# EAGLE design ton-fit_v2 (EAGLE 8.7.0)
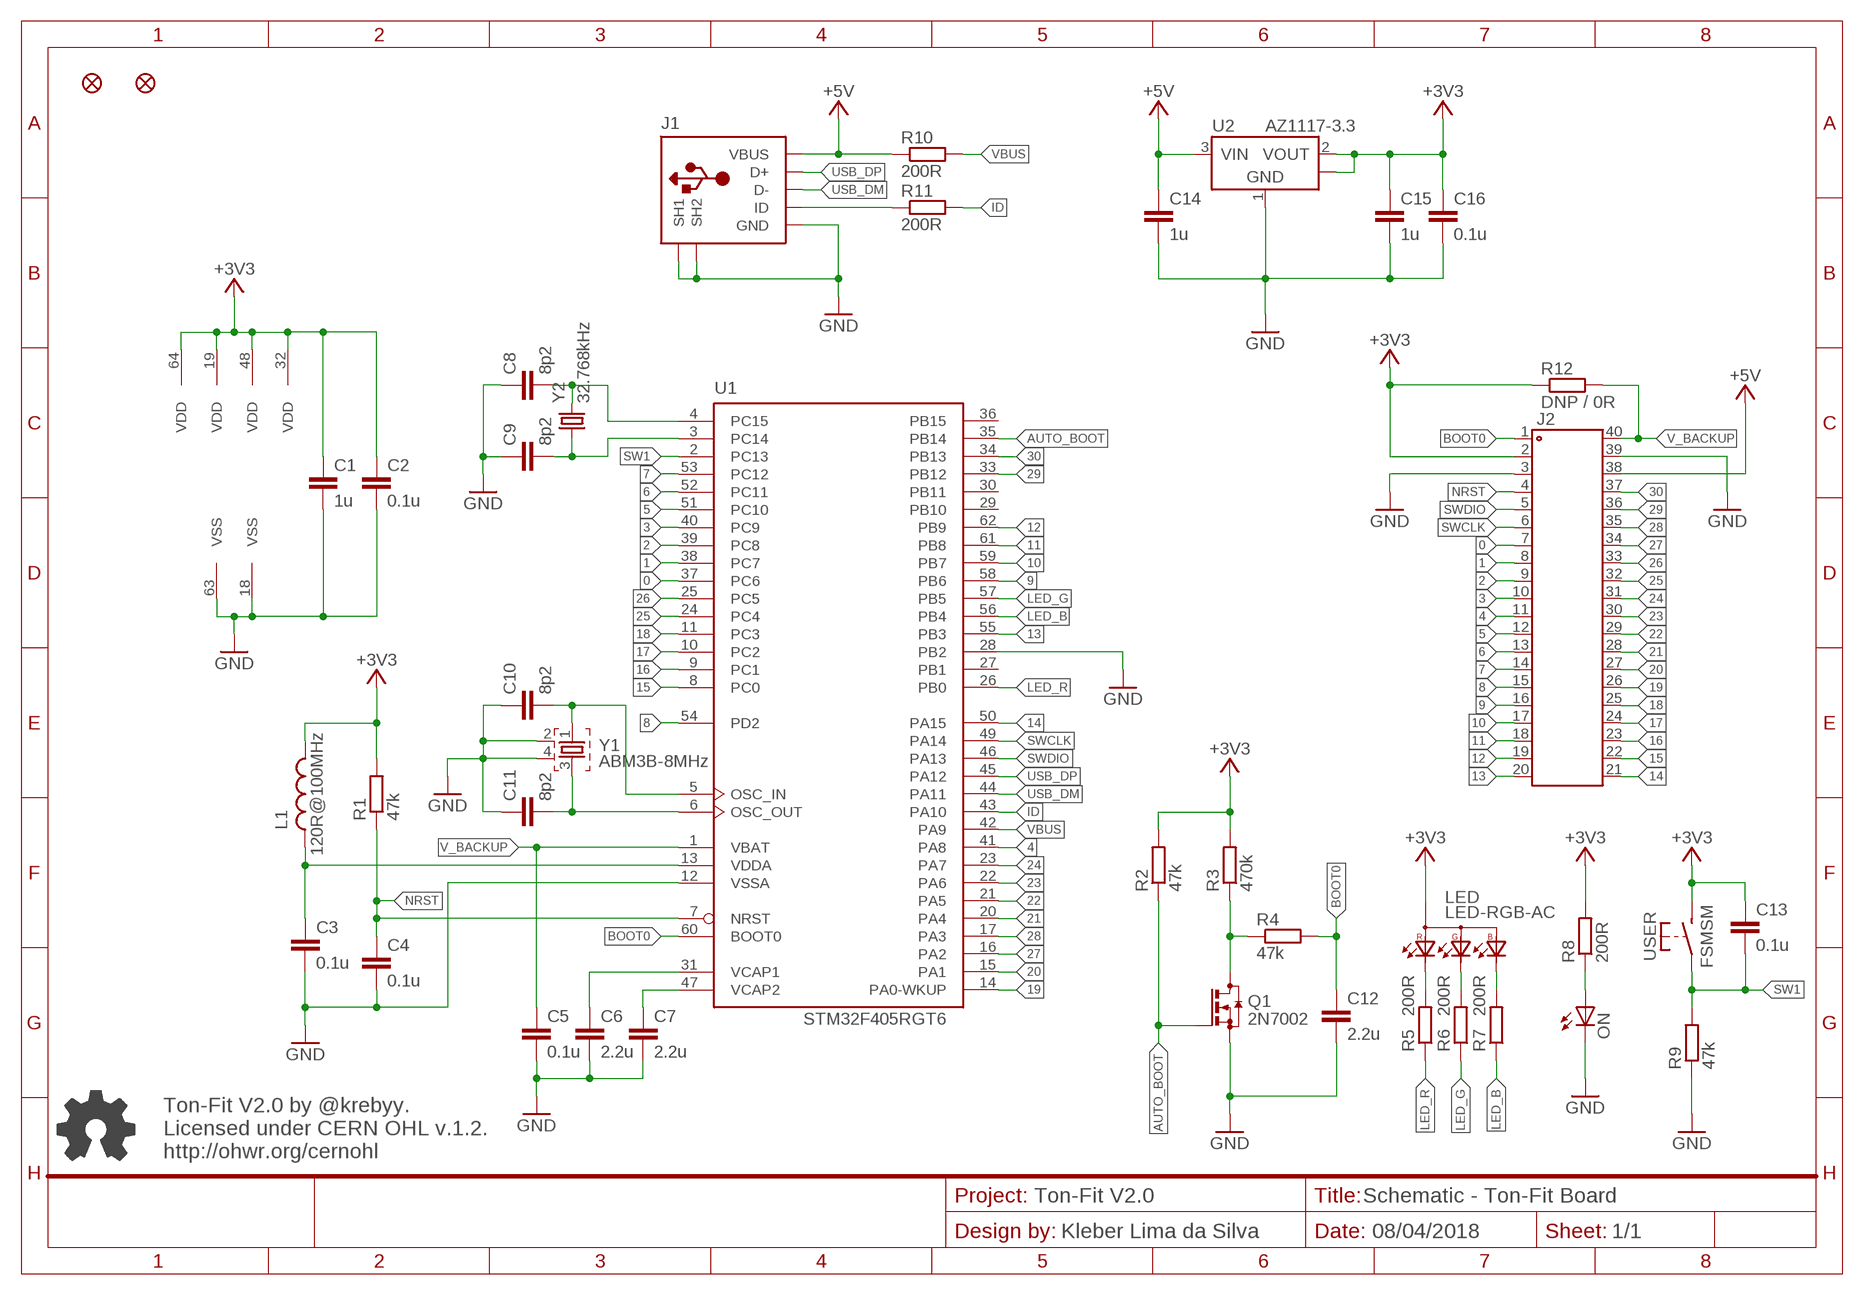
[diagram p0: schematic, sheet 1]

## Parts
C1  1u  C-0603  [C0603]
C2  0.1u  C-0603  [C0603]
C3  0.1u  C-0603  [C0603]
C4  0.1u  C-0603  [C0603]
C5  0.1u  C-0603  [C0603]
C6  2.2u  C-0603  [C0603]
C7  2.2u  C-0603  [C0603]
C8  8p2  C-0603  [C0603]
C9  8p2  C-0603  [C0603]
C10  8p2  C-0603  [C0603]
C11  8p2  C-0603  [C0603]
C12  2.2u  C-0603  [C0603]
C13  0.1u  C-0603  [C0603]
C14  1u  C-0603  [C0603]
C15  1u  C-0603  [C0603]
C16  0.1u  C-0603  [C0603]
FIDUCIAL1  FIDUCIAL  [FIDUCIAL-1X2]
FIDUCIAL2  FIDUCIAL  [FIDUCIAL-1X2]
J1  USBR  [0475890001]
J2  DIL40  [DIL40]
L1  120R@100MHz  L-0603  [L0603]
LED  LED-RGB-AC  [0606]
ON  LEDCHIPLED_0603  [CHIPLED_0603]
Q1  2N7002  N-MOS-SOT23  [SOT23]
R1  47k  R-0603  [R0603]
R2  47k  R-0603  [R0603]
R3  470k  R-0603  [R0603]
R4  47k  R-0603  [R0603]
R5  200R  R-0603  [R0603]
R6  200R  R-0603  [R0603]
R7  200R  R-0603  [R0603]
R8  200R  R-0603  [R0603]
R9  47k  R-0603  [R0603]
R10  200R  R-0603  [R0603]
R11  200R  R-0603  [R0603]
R12  DNP / 0R  R-0603  [R0603]
U1  STM32F405RGT6  STM32F405RGT  [LQFP64]
U2  AZ1117-3.3  V-REG  [SOT223]
USER  FSMSM  SW-MON  [FSMSM]
Y1  ABM3B-8MHz  FA-ABM3B  [ABM3B]
Y2  32.768kHz  CRYSTAL_32.768K  [3.2X1.5]

## Nets
0: J2.7 U1.37(PC6)
1: J2.8 U1.38(PC7)
2: J2.9 U1.39(PC8)
3: J2.10 U1.40(PC9)
4: J2.11 U1.41(PA8)
5: J2.12 U1.51(PC10)
6: J2.13 U1.52(PC11)
7: J2.14 U1.53(PC12)
8: J2.15 U1.54(PD2)
9: J2.16 U1.58(PB6)
10: J2.17 U1.59(PB7)
11: J2.18 U1.61(PB8)
12: J2.19 U1.62(PB9)
13: J2.20 U1.55(PB3)
14: J2.21 U1.50(PA15)
15: J2.22 U1.8(PC0)
16: J2.23 U1.9(PC1)
17: J2.24 U1.10(PC2)
18: J2.25 U1.11(PC3)
19: J2.26 U1.14(PA0-WKUP)
20: J2.27 U1.15(PA1)
21: J2.28 U1.20(PA4)
22: J2.29 U1.21(PA5)
23: J2.30 U1.22(PA6)
24: J2.31 U1.23(PA7)
25: J2.32 U1.24(PC4)
26: J2.33 U1.25(PC5)
27: J2.34 U1.16(PA2)
28: J2.35 U1.17(PA3)
29: J2.36 U1.33(PB12)
30: J2.37 U1.34(PB13)
+3V3: C1.1 C2.1 C13.1 C15.1 C16.1 J2.2 L1.1 LED.4(A) R1.2 R2.2 R3.2 R8.2 R12.1 U1.19(VDD) U1.32(VDD) U1.48(VDD) U1.64(VDD) U2.2(VOUT) U2.4(TAB) USER.2
+5V: C14.1 J1.1(VBUS) J2.38 R10.1 U2.3(VIN)
AUTO_BOOT: Q1.1(G) R2.1 U1.35(PB14)
BOOT0: C12.1 J2.1 R4.2 U1.60(BOOT0)
GND: C1.2 C2.2 C3.2 C4.2 C5.2 C6.2 C7.2 C8.1 C9.1 C10.1 C11.1 C12.2 C14.2 C15.2 C16.2 J1.5(GND) J1.SH1 J1.SH2(SH1) J1.SH3(SH2) J1.SH4(SH2) J1.SH5(SH1) J1.SH6(SH2) J2.3 J2.39 ON.C Q1.2(S) R9.1 U1.12(VSSA) U1.18(VSS) U1.28(PB2) U1.63(VSS) U2.1(GND) Y1.2 Y1.4
ID: R11.2 U1.43(PA10)
LED_B: R7.1 U1.56(PB4)
LED_G: R6.1 U1.57(PB5)
LED_R: R5.1 U1.26(PB0)
N$1: C10.2 U1.5(OSC_IN) Y1.1
N$2: C11.2 U1.6(OSC_OUT) Y1.3
N$3: ON.A R8.1
N$4: LED.1(KRED) R5.2
N$5: C6.1 U1.31(VCAP1)
N$6: C7.1 U1.47(VCAP2)
N$7: LED.2(KGREEN) R6.2
N$8: LED.3(KBLUE) R7.2
N$9: C3.1 L1.2 U1.13(VDDA)
N$11: C8.2 U1.4(PC15) Y2.2
N$12: Q1.3(D) R3.1 R4.1
N$15: C9.2 U1.3(PC14) Y2.1
NRST: C4.1 J2.4 R1.1 U1.7(NRST)
SW1: C13.2 R9.2 U1.2(PC13) USER.1
SWCLK: J2.6 U1.49(PA14)
SWDIO: J2.5 U1.46(PA13)
USB_DM: J1.2(D-) U1.44(PA11)
USB_DP: J1.3(D+) U1.45(PA12)
USB_ID: J1.4(ID) R11.1
V_BACKUP: C5.1 J2.40 R12.2 U1.1(VBAT)
VBUS: R10.2 U1.42(PA9)
Unconnected: U1.27(PB1) U1.29(PB10) U1.30(PB11) U1.36(PB15)

## Notes on the sheet
- Ton-Fit V2.0 by @krebyy.
  Licensed under CERN OHL v.1.2.
  http://ohwr.org/cernohl
- Ton-Fit V2.0
- Kleber Lima da Silva

## Library data of the parts
C1-C16 = Exacta-Eagle-Libraries:C-: CAPACITOR
FIDUCIAL1 FIDUCIAL2 = Exacta-Eagle-Libraries:FIDUCIAL: Fiducial PCB mark
J1 = ioton:USB: Hirose MicroUSB A/B Connector
J2 = ioton:DIL40: Dual In Line
L1 = Exacta-Eagle-Libraries:L-: INDUCTOR / FERRITE BEAD
LED = pololu:LED-RGB-AC
ON = led:LED: LED OSRAM: - CHIPLED LG R971, LG N971, LY N971, LG Q971, LY Q971, LO R971, LY R971 LH N974, LH R974 LS Q976, LO Q976, LY Q976 LO Q996 - Hyper CHIPLED LW Q18S LB Q993, LB Q99A, LB R99A - SideLED LS A670, LO A670, LY A670, LG A670, LP A670 LB A673, LV A673, LT A673, LW A673 LH A674 LY A675 LS A676, LA A676, LO A676, LY A676, LW A676 LS A679, LY A679, LG A679 - Hyper Micro SIDELED® LS Y876, LA Y876, LO Y876, LY Y876 LT Y87S - SmartLED LW L88C, LW L88S LB L89C, LB L89S, LG L890 LS L89K, LO L89K, LY L89K LS L896, LA L896, LO L896, LY L896 - TOPLED LS T670, LO T670, LY T670, LG T670, LP T670 LSG T670, LSP T670, LSY T670, LOP T670, LYG T670 LG T671, LOG T671, LSG T671 LB T673, LV T673, LT T673, LW T673 LH T674 LS T676, LA T676, LO T676, LY T676, LB T676, LH T676, LSB T676, LW T676 LB T67C, LV T67C, LT T67C, LS T67K, LO T67K, LY T67K, LW E67C LS E67B, LA E67B, LO E67B, LY E67B, LB E67C, LV E67C, LT E67C LW T67C LS T679, LY T679, LG T679 LS T770, LO T770, LY T770, LG T770, LP T770 LB T773, LV T773, LT T773, LW T773 LH T774 LS E675, LA E675, LY E675, LS T675 LS T776, LA T776, LO T776, LY T776, LB T776 LHGB T686 LT T68C, LB T68C - Hyper Mini TOPLED® LB M676 - Mini TOPLED Santana® LG M470 LS M47K, LO M47K, LY M47K Source: http://www.osram.convergy.de LUXEON: - LUMILED® LXK2-PW12-R00, LXK2-PW12-S00, LXK2-PW14-U00, LXK2-PW14-V00 LXK2-PM12-R00, LXK2-PM12-S00, LXK2-PM14-U00 LXK2-PE12-Q00, LXK2-PE12-R00, LXK2-PE12-S00, LXK2-PE14-T00, LXK2-PE14-U00 LXK2-PB12-K00, LXK2-PB12-L00, LXK2-PB12-M00, LXK2-PB14-N00, LXK2-PB14-P00, LXK2-PB14-Q00 LXK2-PR12-L00, LXK2-PR12-M00, LXK2-PR14-Q00, LXK2-PR14-R00 LXK2-PD12-Q00, LXK2-PD12-R00, LXK2-PD12-S00 LXK2-PH12-R00, LXK2-PH12-S00 LXK2-PL12-P00, LXK2-PL12-Q00, LXK2-PL12-R00 Source: www.luxeon.com KINGBRIGHT: KA-3528ASYC Source: www.kingbright.com
Q1 = Exacta-Eagle-Libraries:N-MOS-: N-channel MOSFET
R1-R12 = Exacta-Eagle-Libraries:R-: RESISTOR
U1 = micro-stm_v2:STM32F405R*T: ARM 32-bit Cortex™-M3 CPU 168 MHz maximum frequency 1024 Kbytes of Flash memory 192 kbytes of SRAM 51 GPIOs 1.8 to 3.6 V application supply
U2 = Exacta-Eagle-Libraries:V-REG: Linear Voltage Regulator
USER = Exacta-Eagle-Libraries:SW-
Y1 = ioton:FA-: MHz RANGE CRYSTAL UNIT Source: Epson Toyocom
Y2 = ioton:CRYSTAL_32.768K

## Board
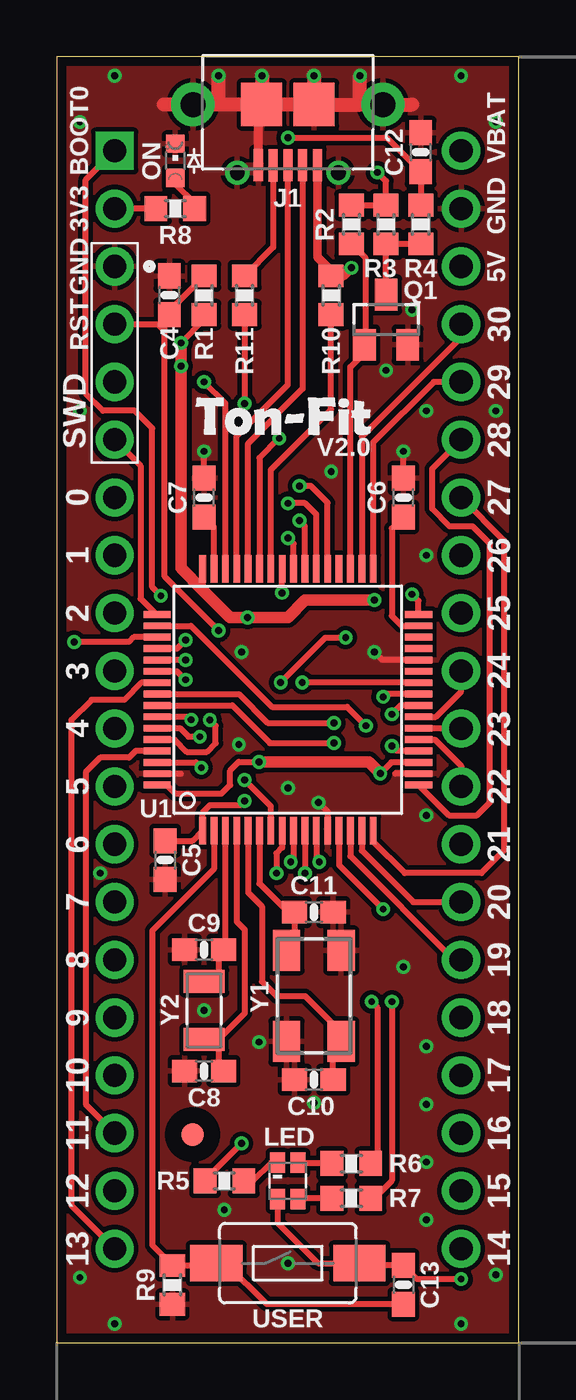
[diagram p1: board, top side]
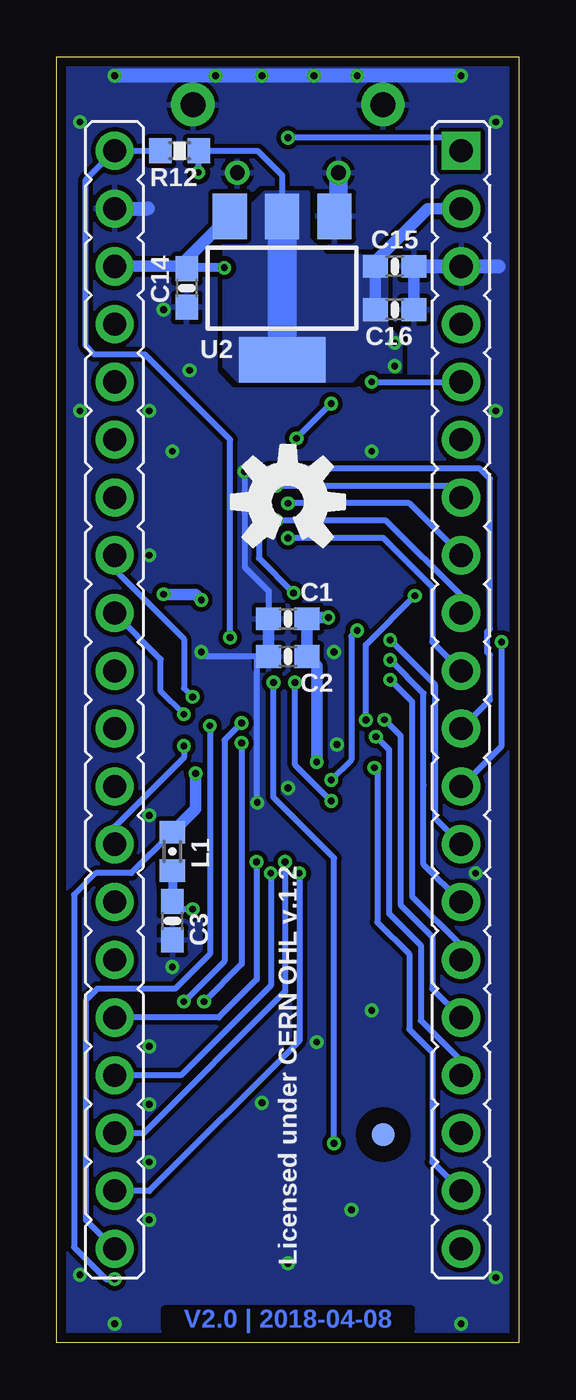
[diagram p2: board, bottom side, seen from below]

Size 20.32 x 56.52 mm. Coordinates in mm from the lower left corner, seen from the top.
Outline: 0,0 20.32,0 20.32,56.52 0,56.52 0,0
Copper layers (1*16): Top 0.035mm / dielectric 1.5mm / Bottom 0.035mm
Design rules "default *": minimum track width 6mil, minimum drill 0.3mm, track to track 8mil, track to pad 7mil, pad to pad 6mil, via to via 7mil, smd to smd 0mil, copper to edge 16mil, drill to drill 8mil, minimum pad ring 8mil, minimum via ring 6mil, stop-mask expansion 4mil, vias tented up to drill 19mil, thermal gap 8mil

### Footprints (pad centres in the part's own frame; a part is rotated, then mirrored left to right if it is on the bottom)
C0603 = smd 1.1 x 1: 1 -0.85,0; 2 0.85,0
FIDUCIAL-1X2 = smd 1 x 1: 1 0,0
0475890001 = smd 0.4 x 1.4: 1 -1.3,2.675; 2 -0.65,2.675; 3 0,2.675; 4 0.65,2.675; 5 1.3,2.675 | drill 1.1 pad 1.9: SH1 -4.175,0; SH4 4.175,0 | smd 1.8 x 1.9: SH2 -1.15,0; SH3 1.15,0 | drill 0.65 pad 1.05: SH5 -2.225,3; SH6 2.225,3
DIL40 = drill 1.016 pad 1.676 square: 1 -24.13,-7.62 | drill 1.016 pad 1.676: 2 -21.59,-7.62; 3 -19.05,-7.62; 4 -16.51,-7.62; 5 -13.97,-7.62; 6 -11.43,-7.62; 7 -8.89,-7.62; 8 -6.35,-7.62; 9 -3.81,-7.62; 10 -1.27,-7.62; 11 1.27,-7.62; 12 3.81,-7.62; 13 6.35,-7.62; 14 8.89,-7.62; 15 11.43,-7.62; 16 13.97,-7.62; 17 16.51,-7.62; 18 19.05,-7.62; 19 21.59,-7.62; 20 24.13,-7.62; 21 24.13,7.62; 22 21.59,7.62; 23 19.05,7.62; 24 16.51,7.62; 25 13.97,7.62; 26 11.43,7.62; 27 8.89,7.62; 28 6.35,7.62; 29 3.81,7.62; 30 1.27,7.62; 31 -1.27,7.62; 32 -3.81,7.62; 33 -6.35,7.62; 34 -8.89,7.62; 35 -11.43,7.62; 36 -13.97,7.62; 37 -16.51,7.62; 38 -19.05,7.62; 39 -21.59,7.62; 40 -24.13,7.62
L0603 = smd 1 x 1.1: 1 -0.85,0; 2 0.85,0
0606 = smd 0.65 x 0.9: 1 -0.45,0.8; 2 0.45,0.8; 3 0.45,-0.8; 4 -0.45,-0.8
CHIPLED_0603 = smd 0.8 x 0.8: A 0,-0.75; C 0,0.75
SOT23 = smd 1 x 1.4: 1 -0.95,-1.1; 2 0.95,-1.1; 3 0,1.1
R0603 = smd 1 x 1.1: 1 -0.85,0; 2 0.85,0
LQFP64 = smd 0.3 x 1.2: 1 -3.75,-5.75; 2 -3.25,-5.75; 3 -2.75,-5.75; 4 -2.25,-5.75; 5 -1.75,-5.75; 6 -1.25,-5.75; 7 -0.75,-5.75; 8 -0.25,-5.75; 9 0.25,-5.75; 10 0.75,-5.75; 11 1.25,-5.75; 12 1.75,-5.75; 13 2.25,-5.75; 14 2.75,-5.75; 15 3.25,-5.75; 16 3.75,-5.75; 33 3.75,5.75; 34 3.25,5.75; 35 2.75,5.75; 36 2.25,5.75; 37 1.75,5.75; 38 1.25,5.75; 39 0.75,5.75; 40 0.25,5.75; 41 -0.25,5.75; 42 -0.75,5.75; 43 -1.25,5.75; 44 -1.75,5.75; 45 -2.25,5.75; 46 -2.75,5.75; 47 -3.25,5.75; 48 -3.75,5.75 | smd 1.2 x 0.3: 17 5.75,-3.75; 18 5.75,-3.25; 19 5.75,-2.75; 20 5.75,-2.25; 21 5.75,-1.75; 22 5.75,-1.25; 23 5.75,-0.75; 24 5.75,-0.25; 25 5.75,0.25; 26 5.75,0.75; 27 5.75,1.25; 28 5.75,1.75; 29 5.75,2.25; 30 5.75,2.75; 31 5.75,3.25; 32 5.75,3.75; 49 -5.75,3.75; 50 -5.75,3.25; 51 -5.75,2.75; 52 -5.75,2.25; 53 -5.75,1.75; 54 -5.75,1.25; 55 -5.75,0.75; 56 -5.75,0.25; 57 -5.75,-0.25; 58 -5.75,-0.75; 59 -5.75,-1.25; 60 -5.75,-1.75; 61 -5.75,-2.25; 62 -5.75,-2.75; 63 -5.75,-3.25; 64 -5.75,-3.75
SOT223 = smd 1.5 x 2: 1 -2.3,-3.15; 2 0,-3.15; 3 2.3,-3.15 | smd 3.8 x 2: 4 0,3.15
FSMSM = smd 2.3 x 1.6: 1 -3.15,0; 2 3.15,0
ABM3B = smd 1.8 x 1.2: 1 -2,-1.2; 2 2,-1.2; 3 2,1.2; 4 -2,1.2
3.2X1.5 = smd 1 x 1.8: 1 -1.275,0; 2 1.275,0

### Placement (x,y rotation side)
C1  10.16,31.81 180 bottom
C2  10.16,30.16 180 bottom
C3  15.24,18.54 270 bottom
C4  4.95,46.04 90 top
C5  4.76,21.21 270 top
C6  15.24,37.15 90 top
C7  6.48,37.15 90 top
C8  6.48,11.94 0 top
C9  6.48,17.27 0 top
C10  11.3,11.56 0 top
C11  11.3,18.92 180 top
C12  16,52.32 90 top
C13  15.24,2.54 270 top
C14  14.61,46.35 270 bottom
C15  5.46,47.31 0 bottom
C16  5.46,45.4 0 bottom
FIDUCIAL1  5.97,9.14 0 top
FIDUCIAL2  5.97,9.14 0 bottom
J1  10.16,54.42 180 top
J2  10.16,28.26 270 top
L1  15.24,21.59 270 bottom
LED  10.16,7.11 0 top
ON  5.21,51.94 0 top
Q1  14.48,44.96 0 top
R1  6.48,46.04 270 top
R2  12.95,49.15 90 top
R3  14.48,49.15 90 top
R4  16,49.15 90 top
R5  7.37,7.11 0 top
R6  12.95,7.87 180 top
R7  12.95,6.35 180 top
R8  5.21,49.85 180 top
R9  5.08,2.54 90 top
R10  12.06,46.04 270 top
R11  8.26,46.04 270 top
R12  14.92,52.39 180 bottom
U1  10.16,28.26 0 top
U2  10.41,46.35 180 bottom
U$1  [OSHW-LOGO-M]  10.16,36.96 0 bottom
USER  10.16,3.49 0 top
Y1  11.3,15.24 90 top
Y2  6.48,14.61 270 top

### Tracks (layer width: path | path; a pad name or v marks a point on that pad's centre or on a via)
0  (via drill 0.3)
  Top 0.254: U1.37 11.91,36.92 11.18,37.66 v10.67,37.66
  Bottom 0.254: J2.7 3.05,37.66 v10.67,37.66
1  (via drill 0.3)
  Top 0.254: U1.38 11.41,36.41 10.92,36.89 v10.16,36.89
  Bottom 0.254: J2.8 4.83,36.89 v10.16,36.89
2  (via drill 0.3)
  Top 0.254: U1.39 10.91,35.89 v10.67,36.13
  Bottom 0.254: v10.67,36.13 5.84,36.13 2.54,32.83 J2.9
3  (via drill 0.3)
  Top 0.254: U1.40 10.41,35.12 v10.16,35.37
  Bottom 0.254: v10.16,35.37 5.97,35.37 3.81,33.21 3.81,30.8 J2.10
4  (via drill 0.3)
  Top 0.254: v9.91,32.95 U1.41
  Bottom 0.254: v9.91,32.95 11.43,34.48 11.43,38.04 11.05,38.42 1.71,38.42 1.27,37.97 1.27,31.37 1.4,31.24 1.4,30.35 1.27,30.23 1.27,28.26 J2.11
5  (via drill 0.3)
  Top 0.254: U1.51 3.38,31.01 3.17,30.8 v0.76,30.8
  Bottom 0.254: J2.12 0.76,26.23 v0.76,30.8
6  (via drill 0.3)
  Top 0.254: v5.66,30.88 5.29,30.51 U1.52
  Bottom 0.254: J2.13 3.68,23.05 3.68,28.91 v5.66,30.88
7  (via drill 0.3)
  Top 0.254: v5.66,30.01 U1.53
  Bottom 0.254: J2.14 4.19,21.02 4.19,24.51 4.19,28.54 v5.66,30.01
8  (via drill 0.3)
  Top 0.254: v5.66,29.13 5.29,29.51 U1.54
  Bottom 0.254: v5.66,29.13 4.7,28.17 4.7,24.38 4.7,19.62 2.54,17.46 J2.15
9  (via drill 0.3)
  Top 0.254: v5.91,27.38 5.79,27.51 U1.58
  Bottom 0.254: v5.91,27.38 5.21,26.68 5.21,19.24 3.81,17.84 3.81,15.56 J2.16
10  (via drill 0.3)
  Top 0.254: U1.59 5.41,27.01 5.79,26.63 v6.29,26.63
  Bottom 0.254: v6.29,26.63 5.71,26.06 5.71,18.86 4.32,17.46 4.32,14.16 2.54,12.38 J2.17
11
  Top 0.254: U1.61 3.46,26.01 3.17,25.72 1.91,25.72 1.27,25.08 1.27,10.48 J2.18
12  (via drill 0.3)
  Top 0.254: U1.62 6.12,25.51 v6.35,25.27
  Bottom 0.254: J2.19 3.81,7.94 3.81,12.76 4.83,13.78 4.83,17.08 6.22,18.48 6.22,25.15 v6.35,25.27
13
  Top 0.254: J2.20 0.64,6.03 0.64,27.37 1.52,28.26 2.97,28.26 3.72,29.01 U1.55
14  (via drill 0.3)
  Top 0.254: U1.50 5.89,31.51 9.46,27.94 12.76,27.94 v13.59,27.11
  Bottom 0.254: v13.59,27.11 13.59,17.08 15.11,15.56 18.54,15.56 19.05,15.05 19.05,5.4 J2.21
15  (via drill 0.3)
  Top 0.254: U1.8 9.91,21.76 9.66,21.51 v9.66,20.63
  Bottom 0.254: v9.66,20.63 9.66,13.26 16.26,6.67 J2.22
16  (via drill 0.3)
  Top 0.254: U1.9 10.41,21.26 v10.29,21.13
  Bottom 0.254: v10.29,21.13 10.29,15.43 16.51,9.21 J2.23
17  (via drill 0.3)
  Top 0.254: U1.10 v10.91,20.63
  Bottom 0.254: v10.91,20.63 10.91,15.7 14.86,11.75 J2.24
18  (via drill 0.3)
  Top 0.254: U1.11 11.41,21.26 v11.54,21.13
  Bottom 0.254: v11.54,21.13 11.54,15.96 13.21,14.29 J2.25
19
  Top 0.254: U1.14 12.91,21.38 17.46,16.83 J2.26
20
  Top 0.254: U1.15 13.41,21.63 15.68,19.37 J2.27
21  (via drill 0.3)
  Top 0.254: U1.20 14.95,26.01 v14.73,26.23
  Bottom 0.254: v14.73,26.23 14.73,25.72 17.78,22.67 J2.28
22
  Top 0.254: U1.21 16.62,26.51 17.78,25.35 J2.29
23
  Top 0.254: U1.22 17.76,27.01 J2.30
24
  Top 0.254: U1.23 16.66,27.51 17.78,28.63 J2.31
25  (via drill 0.3)
  Top 0.254: U1.24 15.12,28.01 v14.73,27.62
  Bottom 0.254: v14.73,27.62 15.75,28.64 15.75,30.04 J2.32
26  (via drill 0.3)
  Top 0.254: U1.25 14.47,28.51 v14.35,28.38
  Bottom 0.254: J2.33 17.78,33.97 14.73,30.92 14.73,28.77 v14.35,28.38
27
  Top 0.254: J2.34 19.68,35.24 19.68,21.65 18.67,20.64 15.3,20.64 13.91,22.03 U1.16
28
  Top 0.254: U1.17 17.24,23.18 18.48,23.18 19.05,23.75 19.05,35.12 18.29,35.88 17.27,35.88 16.51,36.64 16.51,38.42 J2.35
29
  Top 0.254: J2.36 16.57,42.23 13.91,39.56 U1.33
30
  Top 0.254: J2.37 17.78,44.2 13.41,39.83 U1.34
+3V3  (via drill 0.3)
  Top 0.254: R8.2 J2.2 | LED.4 9.71,5.28 11.49,3.49 USER.2 13.41,3.39 C13.1 15.84,2.79 v17.78,2.79 | U1.64 | 4.42,24.5 U1.64 | R2.2 R3.2 14.48,51.05 v14.1,51.44 | U1.19 14.71,25.51 v14.22,25.02 | U1.48 6.41,33.09 6.41,33.08 | R1.2 6.48,44.96 v5.46,43.94 | v8.89,25.53 8,25.53 7.62,25.15 7.62,24.51 7.24,24.13 5.21,24.13 4.83,24.51 U1.64 | U1.32 15.91,32.6 v15.62,32.89 | U1.64 4.7,24.51
  Top 0.508: v5.46,43.94 v5.46,42.93 5.46,34.04 6.41,33.08 7.62,31.88 v8.38,31.88 10.16,31.88 10.92,32.64 v13.97,32.64 | v14.22,25.02 13.72,25.53 v8.89,25.53
  Bottom 0.254: U2.2 10.41,51.31 11.49,52.39 R12.1 14.1,52.36 v14.1,51.44 | L1.1 17.04,20.64 18.61,20.64 19.56,19.68 19.56,4.19 18.16,2.79 v17.78,2.79
  Bottom 0.508: J2.2 4,49.85 6.31,47.54 C15.1 C16.1 | v14.22,25.02 14.22,23.46 L1.1 | v8.38,31.88 9.25,31.88 C1.1 C2.1 8.89,29.74 v8.89,25.53 | v15.62,32.89 14.22,32.89 v13.97,32.64
  Bottom 1.27: U2.2 U2.4
  pour Bottom (isolate 0.203, no thermals): 9.27,50.55 9.27,48.51 8.64,47.88 8.51,47.75 5.84,47.75 5.84,44.7 5.21,44.07 5.21,42.67 6.99,42.67 7.37,42.29 12.32,42.29 12.95,42.93 12.95,48.77 11.18,50.55
+5V  (via drill 0.3)
  Top 0.381: J1.1 11.46,47.72 12.06,47.12 R10.1
  Top 0.406: R10.1 12.6,46.89 v12.95,47.24
  Bottom 0.406: v12.95,47.24 14.57,47.24 C14.1
  Bottom 0.508: J2.38 14.71,47.31 C14.1 14.61,47.61 U2.3
AUTO_BOOT
  Top 0.254: U1.35 12.91,42.88 13.4,43.37 13.53,43.5 Q1.1 13.56,43.89 13.56,47.69 R2.1
BOOT0  (via drill 0.3)
  Top 0.254: U1.60 5.18,26.51 5.71,25.97 6.6,25.97 6.99,26.35 6.99,27.11 v6.73,27.37 | v4.57,32.83 4.19,33.21 4.19,40.2 3.43,40.96 2.03,40.96 1.27,41.72 1.27,51.12 J2.1 | R4.2 C12.1 14.52,52.96 v10.16,52.96
  Bottom 0.254: v6.73,27.37 6.73,30.67 v4.57,32.83 | J2.1 3.11,52.96 v10.16,52.96
GND  (via drill 0.3)
  Top 0.254: C7.2 v6.48,39.18 | C6.2 v15.24,39.18 | 11.53,23.76 v11.51,23.74 11.91,23.33 U1.12 | 15.93,30.01 14.31,30.01 v13.97,30.35 | U1.18 14.87,25.01 | U1.63 5.46,25.01
  Top 0.406: J1.5 8.86,54.42
  Top 0.61: J1.SH2 13.34,54.42 | 7.11,54.42 v7.11,55.69 | 13.34,54.42 J1.SH1 15.62,54.42 | 13.34,54.42 v13.34,55.69 | J1.SH2 J1.SH3 | J1.SH3 8.86,54.42 7.11,54.42 | v9.02,55.69 J1.SH3 | v11.3,55.69 J1.SH2 | 7.11,54.42 4.7,54.42
  Bottom 0.254: v11.51,23.74 11.51,30.16 C2.2 13.78,30.16 v13.97,30.35 | v12.06,38.29 12.06,34.1 11.01,33.04 C1.2
  Bottom 0.508: C1.2 C2.2 | C15.2 C16.2
  Bottom 0.61: 16.32,49.85 J2.39 18.29,49.85 | 0.89,47.31 J2.3 C15.2 | v2.54,55.69 v7.11,55.69 v13.34,55.69 v17.78,55.69
  Bottom 0.813: 7.93,49.83 J1.SH6
  other vias: 19.3,40.96 1.02,40.96 15.62,45.4 1.02,53.66 19.3,53.66 2.54,0.83 1.02,2.86 17.78,0.83 19.3,2.98 16.26,10.48 16.26,13.02 16.26,7.94 16.26,5.4 16.26,23.18 16.26,40.96 11.3,10.54 6.48,14.61 15.24,16.51 14.48,42.74 8.13,30.35 8,26.29 10.16,24.38 1.91,20.64 10.16,3.49 7.37,5.84 16.26,34.61 8.89,13.21
  pour Top (isolate 0.203): 20.32,56.52 0,56.52 0,-0.64 20.32,-0.64
  pour Bottom (isolate 0.203, rank 2): 20.32,56.52 0,56.52 0,-1.27 20.32,-1.27
ID  (via drill 0.3)
  Top 0.254: R11.2 v8.26,41.27 | v9.78,39.75 8.91,38.88 U1.43
  Bottom 0.254: v8.26,41.27 v9.78,39.75
LED_B  (via drill 0.3)
  Top 0.254: U1.56 8.01,28.51 9.27,27.24 v12.19,27.24 | R7.1 13.97,6.35 14.73,7.11 v14.73,14.99
  Bottom 0.254: v12.19,27.24 12.95,26.48 12.95,16.76 v14.73,14.99
LED_G  (via drill 0.3)
  Top 0.254: v12.19,26.35 9.37,26.35 7.72,28.01 U1.57 | v13.84,14.99 14.1,14.73 14.1,8.17 R6.1
  Bottom 0.254: v12.19,26.35 12.19,16.64 v13.84,14.99
LED_R  (via drill 0.3)
  Top 0.254: U1.26 10.81,29.01 v10.79,29.02 | v8.13,8.76 6.52,7.15 R5.1
  Bottom 0.254: v10.79,29.02 10.79,23.96 8.13,21.3 v8.13,8.76
N$1
  Top 0.254: C10.2 12.15,12.89 Y1.1 12.5,13.66 10.92,15.24 9.65,15.24 9.02,15.88 9.02,19.18 8.41,19.78 U1.5
N$2
  Top 0.254: Y1.3 10.45,17.59 C11.2 10.16,18.92 8.91,20.17 U1.6
N$3
  Top 0.254: ON.A 5.21,50.93 6.06,50.08 R8.1
N$4
  Top 0.254: R5.2 8.64,7.11 9.44,7.91 LED.1
N$5
  Top 0.254: C6.1 14.73,35.79 14.73,31.94 15.16,31.51 U1.31
N$6
  Top 0.254: U1.47 6.91,35.86 C7.1
N$7
  Top 0.254: R6.2 10.65,7.87 LED.2
N$8
  Top 0.254: R7.2 10.65,6.35 LED.3
N$9  (via drill 0.3)
  Top 0.254: U1.13 12.41,20.99 v14.35,19.05
  Bottom 0.254: v14.35,19.05 14.9,19.05 C3.1
  Bottom 0.406: L1.2 C3.1
N$11
  Top 0.254: Y2.2 7.11,13.34 | 7.11,13.34 7.11,12.15 C8.2 | U1.4 7.91,18.51 8.26,18.16 8.26,14.48 7.11,13.34
N$12
  Top 0.254: R4.1 R3.1 Q1.3
N$15
  Top 0.254: Y2.1 7.11,15.88 | 7.11,15.88 | U1.3 7.41,17.36 C9.2 7.11,17.05 7.11,15.88
NRST  (via drill 0.3)
  Top 0.254: v7.11,31.3 4.75,33.67 4.75,44.45 | U1.7 9.41,23.57 v8.26,24.73 | 4.75,44.45 4.75,44.98 C4.1 4.95,45.36 R1.1 | J2.4 4.43,44.77 4.75,44.45
  Bottom 0.254: v7.11,31.3 7.37,31.05 7.37,25.62 v8.26,24.73
SW1
  Top 0.254: U1.2 6.91,20.82 4.19,18.1 4.19,4.28 R9.2 6.91,3.39 USER.1 7.43,3.49 9.23,1.69 C13.2
SWCLK
  Top 0.254: J2.6 3.68,38.54 3.68,32.7 4.38,32.01 U1.49
SWDIO  (via drill 0.3)
  Top 0.254: U1.46 7.41,41.29 v6.48,42.23
  Bottom 0.254: v6.48,42.23 J2.5
USB_DM
  Top 0.254: U1.44 8.41,39.52 10.81,41.92 J1.2
USB_DP
  Top 0.254: U1.45 7.91,39.85 10.16,42.1 J1.3
USB_ID
  Top 0.254: J1.4 9.51,48.14 R11.1
V_BACKUP  (via drill 0.3)
  Top 0.254: C5.1 5.96,22.06 U1.1 6.41,23.3 6.73,23.62 8.06,23.62 v8.26,23.81 | v9.84,29.02 11.81,30.99 v12.7,30.99
  Bottom 0.254: v12.7,30.99 12.7,39.69 16.45,43.43 18.67,43.43 19.05,43.81 19.05,51.12 J2.40 R12.2 | v8.26,23.81 9.84,25.4 v9.84,29.02
VBUS
  Top 0.254: U1.42 9.41,38.37 12.06,41.02 R10.2

### Text on the board
Bottom: V2.0 | 2018-04-08
tPlace: BOOT0 | VBAT | 3V3 | GND | GND | 5V | RST | 30 | 29 | SWD | V2.0 | 28 | 0 | 27 | 1 | 26 | 2 | 25 | 3 | 24 | 4 | 23 | 5 | 22 | 6 | 21 | 7 | 20 | 8 | 19 | 9 | 18 | 10 | 17 | 11 | 16 | 12 | 15 | 13 | 14
bPlace: Licensed under CERN OHL v.1.2